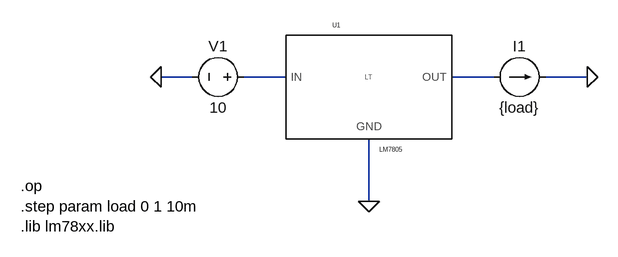
[diagram p0: schematic LM78xx_current_sweep.asc]
LM78xx_current_sweep.asc, the LTspice schematic file:
Version 4
SHEET 1 880 680
WIRE 224 96 176 96
WIRE 368 96 304 96
WIRE 688 96 624 96
WIRE 832 96 768 96
WIRE 496 288 496 192
FLAG 496 288 0
FLAG 832 96 0
FLAG 176 96 0
SYMBOL voltage 320 96 R90
WINDOW 0 -32 56 VBottom 2
WINDOW 3 32 56 VTop 2
WINDOW 123 0 0 Left 0
WINDOW 39 0 0 Left 0
SYMATTR InstName V1
SYMATTR Value 10
SYMBOL lm7805 496 96 R0
SYMATTR InstName U1
SYMBOL current 688 96 R270
WINDOW 0 32 40 VTop 2
WINDOW 3 -32 40 VBottom 2
WINDOW 123 0 0 Left 0
WINDOW 39 0 0 Left 0
SYMATTR InstName I1
SYMATTR Value {load}
TEXT -40 264 Left 2 !.op\n.step param load 0 1 10m\n.lib lm78xx.lib

The netlist it stands for:
* LM78xx_current_sweep.asc
V1 N001 0 10
XU1 N001 0 N002 LM7805  ; pins IN GND OUT
I1 N002 0 {load}
.op
.step param load 0 1 10m
.lib lm78xx.lib
.lib lm78xx.lib
.backanno
.end

* Results of the author's LTspice run, read from the files saved beside the schematic
* From the log:
*   Semiconductor Device Operating Points:
*                           --- Diodes ---
*   Name:    d:u1:z1     d:u1:z2     d:u1:1
*   Model:  u1:d_5v6    u1:d_5v1     u1:d_d
*   Id:     -4.93e-05   -5.40e-08    1.81e-05
*   Vd:     -5.66e+00   -4.86e+00    7.09e-01
*   Req:     5.24e+02    4.79e+05    1.66e+03
*   CAP:     4.07e-13    4.13e-13    1.72e-12
*                           --- Bipolar Transistors ---
*   Name:     q:u1:t9    q:u1:t10    q:u1:t15     q:u1:t4     q:u1:t8
*   Model:   u1:q_pnp    u1:q_pnp    u1:q_pnp    u1:q_npn    u1:q_npn
*   Ib:      -1.78e-05   -1.78e-05   -1.50e-05    2.20e-06    1.33e-06
*   Ic:      -1.43e-03   -1.43e-03   -1.20e-03    1.76e-04    1.06e-04
*   Vbe:     -8.40e-01   -8.40e-01   -8.34e-01    7.77e-01    7.62e-01
*   Vbc:      0.00e+00    2.72e+00    4.40e+00   -1.67e+00   -6.24e-01
*   Vce:     -8.40e-01   -3.56e+00   -5.23e+00    2.45e+00    1.39e+00
*   BetaDC:   8.00e+01    8.00e+01    8.00e+01    8.00e+01    8.00e+01
*   Gm:       4.76e-02    4.76e-02    3.99e-02    5.88e-03    3.54e-03
*   Rpi:      1.68e+03    1.68e+03    2.01e+03    1.36e+04    2.26e+04
*   Rx:       0.00e+00    0.00e+00    0.00e+00    0.00e+00    0.00e+00
*   Ro:       3.00e+13    7.21e+52    1.38e+77    5.08e+37    3.27e+22
*   Cbe:      8.30e-13    8.30e-13    7.52e-13    3.99e-13    3.72e-13
*   Cbc:      1.00e-13    6.03e-14    5.30e-14    6.79e-14    8.19e-14
*   Cjs:      0.00e+00    0.00e+00    0.00e+00    0.00e+00    0.00e+00
*   BetaAC:   8.00e+01    8.00e+01    8.00e+01    8.00e+01    8.00e+01
*   Cbx:      0.00e+00    0.00e+00    0.00e+00    0.00e+00    0.00e+00
*   Ft:       8.14e+09    8.50e+09    7.89e+09    2.00e+09    1.24e+09
*   Name:    q:u1:t11    q:u1:t12    q:u1:t13    q:u1:t16    q:u1:t14
*   Model:   u1:q_npn    u1:q_npn    u1:q_npn    u1:q_npn    u1:q_npn
*   Ib:      -5.36e-12   -1.17e-12    2.55e-07    6.65e-06    2.54e-06
*   Ic:       4.24e-11    2.14e-12    2.04e-05    5.32e-04    2.03e-04
*   Vbe:      3.15e-01    1.33e-01    7.12e-01    7.41e-01    7.81e-01
*   Vbc:     -6.12e+00   -1.30e+00   -2.90e+00   -3.56e+00   -3.62e+00
*   Vce:      6.44e+00    1.44e+00    3.62e+00    4.30e+00    4.40e+00
*   BetaDC:  -7.92e+00   -1.83e+00    8.00e+01    8.00e+01    8.00e+01
*   Gm:       1.21e-09    2.76e-11    6.80e-04    1.77e-02    6.77e-03
*   Rpi:      6.20e+10    7.43e+11    1.18e+05    4.51e+03    1.18e+04
*   Rx:       0.00e+00    0.00e+00    0.00e+00    0.00e+00    0.00e+00
*   Ro:       0.00e+00    2.27e+31    3.32e+55    1.03e+64    6.77e+65
*   Cbe:      2.39e-13    2.13e-12    3.33e-13    3.50e-12    4.09e-13
*   Cbc:      4.81e-14    7.17e-13    5.93e-14    5.62e-13    5.59e-14
*   Cjs:      0.00e+00    0.00e+00    0.00e+00    0.00e+00    0.00e+00
*   BetaAC:   7.50e+01    2.05e+01    8.00e+01    8.00e+01    8.00e+01
*   Cbx:      0.00e+00    0.00e+00    0.00e+00    0.00e+00    0.00e+00
*   Ft:       6.70e+02    1.54e+00    2.76e+08    6.95e+08    2.32e+09
*   Name:    q:u1:t18    q:u1:t17     q:u1:t2     q:u1:t3     q:u1:t1
*   Model:   u1:q_npn    u1:q_npn    u1:q_npn    u1:q_npn    u1:q_npn
*   Ib:       9.03e-07    1.46e-05   -7.94e-12    1.83e-05    4.91e-06
*   Ic:       7.22e-05    1.17e-03    6.96e-12    1.46e-03    3.93e-04
*   Vbe:      7.50e-01    6.95e-01   -9.83e-01    8.40e-01    8.01e-01
*   Vbc:     -1.63e+00   -4.30e+00   -6.96e+00   -4.30e+00   -4.34e+00
*   Vce:      2.38e+00    5.00e+00    5.98e+00    5.14e+00    5.14e+00
*   BetaDC:   8.00e+01    8.00e+01   -8.76e-01    8.00e+01    8.00e+01
*   Gm:       2.41e-03    3.89e-02    1.99e-28    4.87e-02    1.31e-02
*   Rpi:      3.32e+04    2.06e+03    1.00e+12    1.64e+03    6.11e+03
*   Rx:       0.00e+00    0.00e+00    0.00e+00    0.00e+00    0.00e+00
*   Ro:       1.12e+37    5.47e+73    0.00e+00    5.61e+75    2.04e+76
*   Cbe:      3.58e-13    3.26e-11    1.52e-13    8.42e-13    4.77e-13
*   Cbc:      6.83e-14    5.33e-12    4.64e-14    5.33e-14    5.32e-14
*   Cjs:      0.00e+00    0.00e+00    0.00e+00    0.00e+00    0.00e+00
*   BetaAC:   8.00e+01    8.00e+01    1.99e-16    8.00e+01    8.00e+01
*   Cbx:      0.00e+00    0.00e+00    0.00e+00    0.00e+00    0.00e+00
*   Ft:       8.98e+08    1.63e+08    8.04e-01    8.67e+09    3.93e+09
*   Name:     q:u1:t5     q:u1:t7     q:u1:t6
*   Model:   u1:q_npn    u1:q_npn    u1:q_npn
*   Ib:       1.85e-05    8.59e-06    1.00e-05
*   Ic:       1.48e-03    6.87e-04    8.03e-04
*   Vbe:      8.41e-01    8.18e-01    8.22e-01
*   Vbc:      7.05e-03   -1.54e+00   -7.97e-01
*   Vce:      8.34e-01    2.36e+00    1.62e+00
*   BetaDC:   8.00e+01    8.00e+01    8.00e+01
*   Gm:       4.94e-02    2.29e-02    2.68e-02
*   Rpi:      1.62e+03    3.49e+03    2.99e+03
*   Rx:       0.00e+00    0.00e+00    0.00e+00
*   Ro:       2.37e+13    6.67e+35    1.03e+25
*   Cbe:      8.48e-13    5.78e-13    6.18e-13
*   Cbc:      1.00e-13    6.91e-14    7.88e-14
*   Cjs:      0.00e+00    0.00e+00    0.00e+00
*   BetaAC:   8.00e+01    8.00e+01    8.00e+01
*   Cbx:      0.00e+00    0.00e+00    0.00e+00
*   Ft:       8.28e+09    5.63e+09    6.11e+09